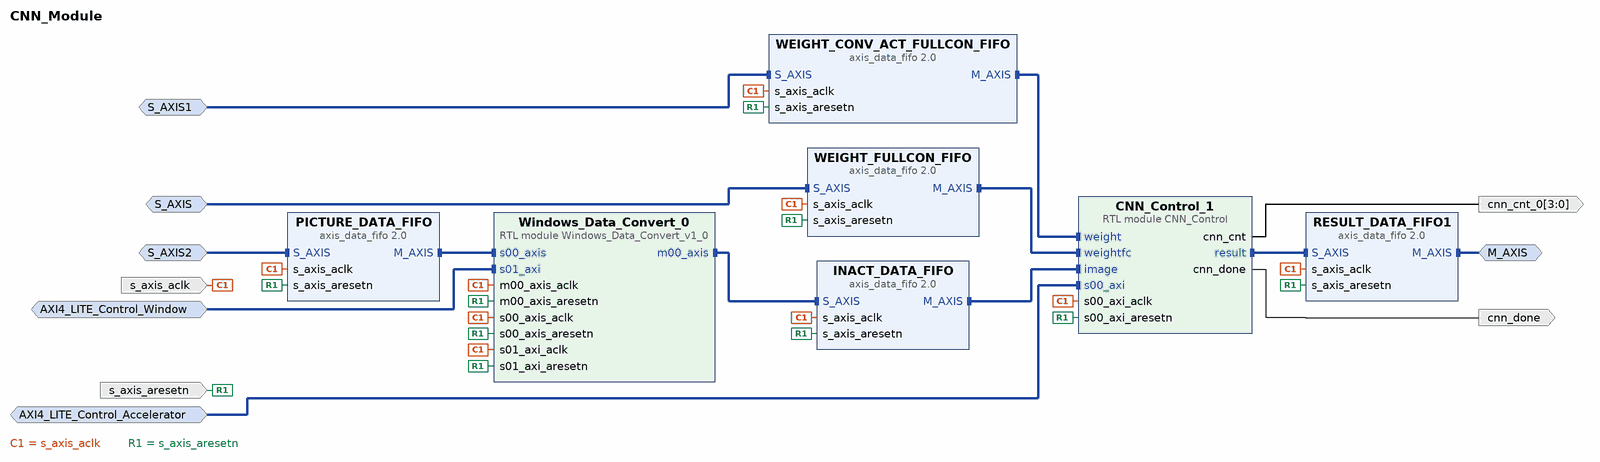
[diagram p0: block diagram of the top level]
# Vivado block design CNN_Module, xc7z020clg400-1, Vivado 2022.1
create_bd_design CNN_Module

create_bd_intf_port -mode Slave -vlnv xilinx.com:interface:aximm_rtl:1.0 AXI4_LITE_Control_Accelerator
set_property -dict [list \
  CONFIG.ADDR_WIDTH 31 \
  CONFIG.ARUSER_WIDTH 0 \
  CONFIG.AWUSER_WIDTH 0 \
  CONFIG.BUSER_WIDTH 0 \
  CONFIG.DATA_WIDTH 32 \
  CONFIG.FREQ_HZ 50000000 \
  CONFIG.HAS_BRESP 1 \
  CONFIG.HAS_BURST 0 \
  CONFIG.HAS_CACHE 0 \
  CONFIG.HAS_LOCK 0 \
  CONFIG.HAS_PROT 1 \
  CONFIG.HAS_QOS 0 \
  CONFIG.HAS_REGION 0 \
  CONFIG.HAS_RRESP 1 \
  CONFIG.HAS_WSTRB 1 \
  CONFIG.ID_WIDTH 0 \
  CONFIG.MAX_BURST_LENGTH 1 \
  CONFIG.NUM_READ_OUTSTANDING 1 \
  CONFIG.NUM_READ_THREADS 1 \
  CONFIG.NUM_WRITE_OUTSTANDING 1 \
  CONFIG.NUM_WRITE_THREADS 1 \
  CONFIG.PROTOCOL AXI4LITE \
  CONFIG.READ_WRITE_MODE READ_WRITE \
  CONFIG.RUSER_BITS_PER_BYTE 0 \
  CONFIG.RUSER_WIDTH 0 \
  CONFIG.SUPPORTS_NARROW_BURST 0 \
  CONFIG.WUSER_BITS_PER_BYTE 0 \
  CONFIG.WUSER_WIDTH 0 \
] [get_bd_intf_ports AXI4_LITE_Control_Accelerator]
create_bd_intf_port -mode Slave -vlnv xilinx.com:interface:aximm_rtl:1.0 AXI4_LITE_Control_Window
set_property -dict [list \
  CONFIG.ADDR_WIDTH 31 \
  CONFIG.ARUSER_WIDTH 0 \
  CONFIG.AWUSER_WIDTH 0 \
  CONFIG.BUSER_WIDTH 0 \
  CONFIG.DATA_WIDTH 32 \
  CONFIG.FREQ_HZ 50000000 \
  CONFIG.HAS_BRESP 1 \
  CONFIG.HAS_BURST 0 \
  CONFIG.HAS_CACHE 0 \
  CONFIG.HAS_LOCK 0 \
  CONFIG.HAS_PROT 1 \
  CONFIG.HAS_QOS 0 \
  CONFIG.HAS_REGION 0 \
  CONFIG.HAS_RRESP 1 \
  CONFIG.HAS_WSTRB 1 \
  CONFIG.ID_WIDTH 0 \
  CONFIG.MAX_BURST_LENGTH 1 \
  CONFIG.NUM_READ_OUTSTANDING 1 \
  CONFIG.NUM_READ_THREADS 1 \
  CONFIG.NUM_WRITE_OUTSTANDING 1 \
  CONFIG.NUM_WRITE_THREADS 1 \
  CONFIG.PROTOCOL AXI4LITE \
  CONFIG.READ_WRITE_MODE READ_WRITE \
  CONFIG.RUSER_BITS_PER_BYTE 0 \
  CONFIG.RUSER_WIDTH 0 \
  CONFIG.SUPPORTS_NARROW_BURST 0 \
  CONFIG.WUSER_BITS_PER_BYTE 0 \
  CONFIG.WUSER_WIDTH 0 \
] [get_bd_intf_ports AXI4_LITE_Control_Window]
create_bd_intf_port -mode Master -vlnv xilinx.com:interface:axis_rtl:1.0 M_AXIS
set_property -dict {CONFIG.FREQ_HZ 50000000} [get_bd_intf_ports M_AXIS]
create_bd_intf_port -mode Slave -vlnv xilinx.com:interface:axis_rtl:1.0 S_AXIS
set_property -dict [list \
  CONFIG.FREQ_HZ 50000000 \
  CONFIG.HAS_TKEEP 1 \
  CONFIG.HAS_TLAST 1 \
  CONFIG.HAS_TREADY 1 \
  CONFIG.HAS_TSTRB 1 \
  CONFIG.LAYERED_METADATA undef \
  CONFIG.TDATA_NUM_BYTES 8 \
  CONFIG.TDEST_WIDTH 0 \
  CONFIG.TID_WIDTH 0 \
  CONFIG.TUSER_WIDTH 0 \
] [get_bd_intf_ports S_AXIS]
create_bd_intf_port -mode Slave -vlnv xilinx.com:interface:axis_rtl:1.0 S_AXIS1
set_property -dict [list \
  CONFIG.FREQ_HZ 50000000 \
  CONFIG.HAS_TKEEP 1 \
  CONFIG.HAS_TLAST 1 \
  CONFIG.HAS_TREADY 1 \
  CONFIG.HAS_TSTRB 1 \
  CONFIG.LAYERED_METADATA undef \
  CONFIG.TDATA_NUM_BYTES 8 \
  CONFIG.TDEST_WIDTH 0 \
  CONFIG.TID_WIDTH 0 \
  CONFIG.TUSER_WIDTH 0 \
] [get_bd_intf_ports S_AXIS1]
create_bd_intf_port -mode Slave -vlnv xilinx.com:interface:axis_rtl:1.0 S_AXIS2
set_property -dict [list \
  CONFIG.FREQ_HZ 50000000 \
  CONFIG.HAS_TKEEP 1 \
  CONFIG.HAS_TLAST 1 \
  CONFIG.HAS_TREADY 1 \
  CONFIG.HAS_TSTRB 0 \
  CONFIG.LAYERED_METADATA undef \
  CONFIG.TDATA_NUM_BYTES 1 \
  CONFIG.TDEST_WIDTH 0 \
  CONFIG.TID_WIDTH 0 \
  CONFIG.TUSER_WIDTH 0 \
] [get_bd_intf_ports S_AXIS2]
create_bd_port -dir O -from 3 -to 0 cnn_cnt_0
create_bd_port -dir O cnn_done
create_bd_port -dir I -type clk s_axis_aclk
set_property -dict [list \
  CONFIG.ASSOCIATED_BUSIF AXI4_LITE_Control_Accelerator:AXI4_LITE_Control_Window:M_AXIS:S_AXIS:S_AXIS1:S_AXIS2 \
  CONFIG.ASSOCIATED_RESET s_axis_aresetn \
  CONFIG.FREQ_HZ 50000000 \
] [get_bd_ports s_axis_aclk]
create_bd_port -dir I -type rst s_axis_aresetn

create_bd_cell -type ip -vlnv xilinx.com:ip:axis_data_fifo:2.0 INACT_DATA_FIFO
set_property -dict [list \
  CONFIG.FIFO_DEPTH 1024 \
  CONFIG.HAS_TKEEP 1 \
  CONFIG.HAS_TLAST 1 \
  CONFIG.HAS_TSTRB 1 \
  CONFIG.TDATA_NUM_BYTES 25 \
] [get_bd_cells INACT_DATA_FIFO]
create_bd_cell -type ip -vlnv xilinx.com:ip:axis_data_fifo:2.0 PICTURE_DATA_FIFO
set_property -dict {CONFIG.FIFO_DEPTH 1024} [get_bd_cells PICTURE_DATA_FIFO]
create_bd_cell -type ip -vlnv xilinx.com:ip:axis_data_fifo:2.0 RESULT_DATA_FIFO1
set_property -dict [list \
  CONFIG.FIFO_DEPTH 2048 \
  CONFIG.HAS_TKEEP 0 \
  CONFIG.HAS_TLAST 1 \
  CONFIG.HAS_TSTRB 0 \
  CONFIG.TDATA_NUM_BYTES 32 \
] [get_bd_cells RESULT_DATA_FIFO1]
create_bd_cell -type ip -vlnv xilinx.com:ip:axis_data_fifo:2.0 WEIGHT_CONV_ACT_FULLCON_FIFO
set_property -dict [list \
  CONFIG.FIFO_DEPTH 512 \
  CONFIG.HAS_TKEEP 1 \
  CONFIG.HAS_TLAST 1 \
  CONFIG.HAS_TSTRB 1 \
  CONFIG.TDATA_NUM_BYTES 8 \
] [get_bd_cells WEIGHT_CONV_ACT_FULLCON_FIFO]
create_bd_cell -type ip -vlnv xilinx.com:ip:axis_data_fifo:2.0 WEIGHT_FULLCON_FIFO
set_property -dict [list \
  CONFIG.FIFO_DEPTH 512 \
  CONFIG.HAS_TKEEP 1 \
  CONFIG.HAS_TLAST 1 \
  CONFIG.HAS_TSTRB 1 \
  CONFIG.TDATA_NUM_BYTES 8 \
] [get_bd_cells WEIGHT_FULLCON_FIFO]
create_bd_cell -type module -reference Windows_Data_Convert_v1_0 Windows_Data_Convert_0
set_property -dict [list \
  CONFIG.AXIS_TDATA_WIDTH 8 \
  CONFIG.DATA_HORIZONTAL 28 \
  CONFIG.DATA_VERTICAL 28 \
  CONFIG.KERNEL_SIZE 5 \
] [get_bd_cells Windows_Data_Convert_0]
create_bd_cell -type module -reference CNN_Control CNN_Control_1
set_property -dict [list \
  CONFIG.CONV_KERNEL_NUM 8 \
  CONFIG.CONV_KERNEL_SIZE 5 \
  CONFIG.FULLCON_INPUT_SIZE 192 \
  CONFIG.FULLCON_OUTPUT_SIZE 8 \
  CONFIG.POOL_KERNEL_SIZE 2 \
  CONFIG.RESULT_NUM 8 \
  CONFIG.SCALE_RIGHT 0 \
] [get_bd_cells CNN_Control_1]

# ---- connections ----

connect_bd_intf_net -intf_net CNN_Control_0_result [get_bd_intf_pins CNN_Control_1/result] [get_bd_intf_pins RESULT_DATA_FIFO1/S_AXIS]
connect_bd_intf_net [get_bd_intf_ports M_AXIS] [get_bd_intf_pins RESULT_DATA_FIFO1/M_AXIS]
connect_bd_intf_net [get_bd_intf_ports S_AXIS2] [get_bd_intf_pins PICTURE_DATA_FIFO/S_AXIS]
connect_bd_intf_net [get_bd_intf_ports S_AXIS] [get_bd_intf_pins WEIGHT_FULLCON_FIFO/S_AXIS]
connect_bd_intf_net [get_bd_intf_ports S_AXIS1] [get_bd_intf_pins WEIGHT_CONV_ACT_FULLCON_FIFO/S_AXIS]
connect_bd_intf_net [get_bd_intf_ports AXI4_LITE_Control_Window] [get_bd_intf_pins Windows_Data_Convert_0/s01_axi]
connect_bd_intf_net -intf_net INACT_DATA_FIFO_M_AXIS [get_bd_intf_pins INACT_DATA_FIFO/M_AXIS] [get_bd_intf_pins CNN_Control_1/image]
connect_bd_intf_net [get_bd_intf_pins Windows_Data_Convert_0/s00_axis] [get_bd_intf_pins PICTURE_DATA_FIFO/M_AXIS]
connect_bd_intf_net -intf_net WEIGHT_CONV_ACT_FULLCON_FIFO_M_AXIS [get_bd_intf_pins WEIGHT_CONV_ACT_FULLCON_FIFO/M_AXIS] [get_bd_intf_pins CNN_Control_1/weight]
connect_bd_intf_net [get_bd_intf_pins WEIGHT_FULLCON_FIFO/M_AXIS] [get_bd_intf_pins CNN_Control_1/weightfc]
connect_bd_intf_net [get_bd_intf_pins INACT_DATA_FIFO/S_AXIS] [get_bd_intf_pins Windows_Data_Convert_0/m00_axis]
connect_bd_intf_net [get_bd_intf_ports AXI4_LITE_Control_Accelerator] [get_bd_intf_pins CNN_Control_1/s00_axi]
connect_bd_net [get_bd_pins CNN_Control_1/cnn_cnt] [get_bd_ports cnn_cnt_0]
connect_bd_net [get_bd_pins CNN_Control_1/cnn_done] [get_bd_ports cnn_done]
connect_bd_net [get_bd_ports s_axis_aclk] \
  [get_bd_pins INACT_DATA_FIFO/s_axis_aclk] [get_bd_pins WEIGHT_CONV_ACT_FULLCON_FIFO/s_axis_aclk] \
  [get_bd_pins WEIGHT_FULLCON_FIFO/s_axis_aclk] [get_bd_pins RESULT_DATA_FIFO1/s_axis_aclk] \
  [get_bd_pins PICTURE_DATA_FIFO/s_axis_aclk] [get_bd_pins Windows_Data_Convert_0/s01_axi_aclk] \
  [get_bd_pins Windows_Data_Convert_0/s00_axis_aclk] [get_bd_pins Windows_Data_Convert_0/m00_axis_aclk] \
  [get_bd_pins CNN_Control_1/s00_axi_aclk]
connect_bd_net [get_bd_ports s_axis_aresetn] \
  [get_bd_pins INACT_DATA_FIFO/s_axis_aresetn] [get_bd_pins WEIGHT_CONV_ACT_FULLCON_FIFO/s_axis_aresetn] \
  [get_bd_pins WEIGHT_FULLCON_FIFO/s_axis_aresetn] [get_bd_pins RESULT_DATA_FIFO1/s_axis_aresetn] \
  [get_bd_pins PICTURE_DATA_FIFO/s_axis_aresetn] [get_bd_pins Windows_Data_Convert_0/s01_axi_aresetn] \
  [get_bd_pins Windows_Data_Convert_0/s00_axis_aresetn] [get_bd_pins Windows_Data_Convert_0/m00_axis_aresetn] \
  [get_bd_pins CNN_Control_1/s00_axi_aresetn]
set_property HDL_ATTRIBUTE.DEBUG true [get_bd_intf_nets CNN_Control_0_result]
set_property HDL_ATTRIBUTE.MARK_DEBUG true [get_bd_intf_nets CNN_Control_0_result]
set_property HDL_ATTRIBUTE.DEBUG true [get_bd_intf_nets INACT_DATA_FIFO_M_AXIS]
set_property HDL_ATTRIBUTE.MARK_DEBUG true [get_bd_intf_nets INACT_DATA_FIFO_M_AXIS]
set_property HDL_ATTRIBUTE.DEBUG true [get_bd_intf_nets WEIGHT_CONV_ACT_FULLCON_FIFO_M_AXIS]
set_property HDL_ATTRIBUTE.MARK_DEBUG true [get_bd_intf_nets WEIGHT_CONV_ACT_FULLCON_FIFO_M_AXIS]

# ---- address map ----
assign_bd_address -offset 0x40000000 -range 4K -target_address_space [get_bd_addr_spaces AXI4_LITE_Control_Accelerator] [get_bd_addr_segs CNN_Control_1/s00_axi/reg0]
assign_bd_address -offset 0x40001000 -range 4K -target_address_space [get_bd_addr_spaces AXI4_LITE_Control_Window] [get_bd_addr_segs Windows_Data_Convert_0/s01_axi/reg0]

validate_bd_design
save_bd_design
